# EAGLE design HBridge (EAGLE 6.5.0)
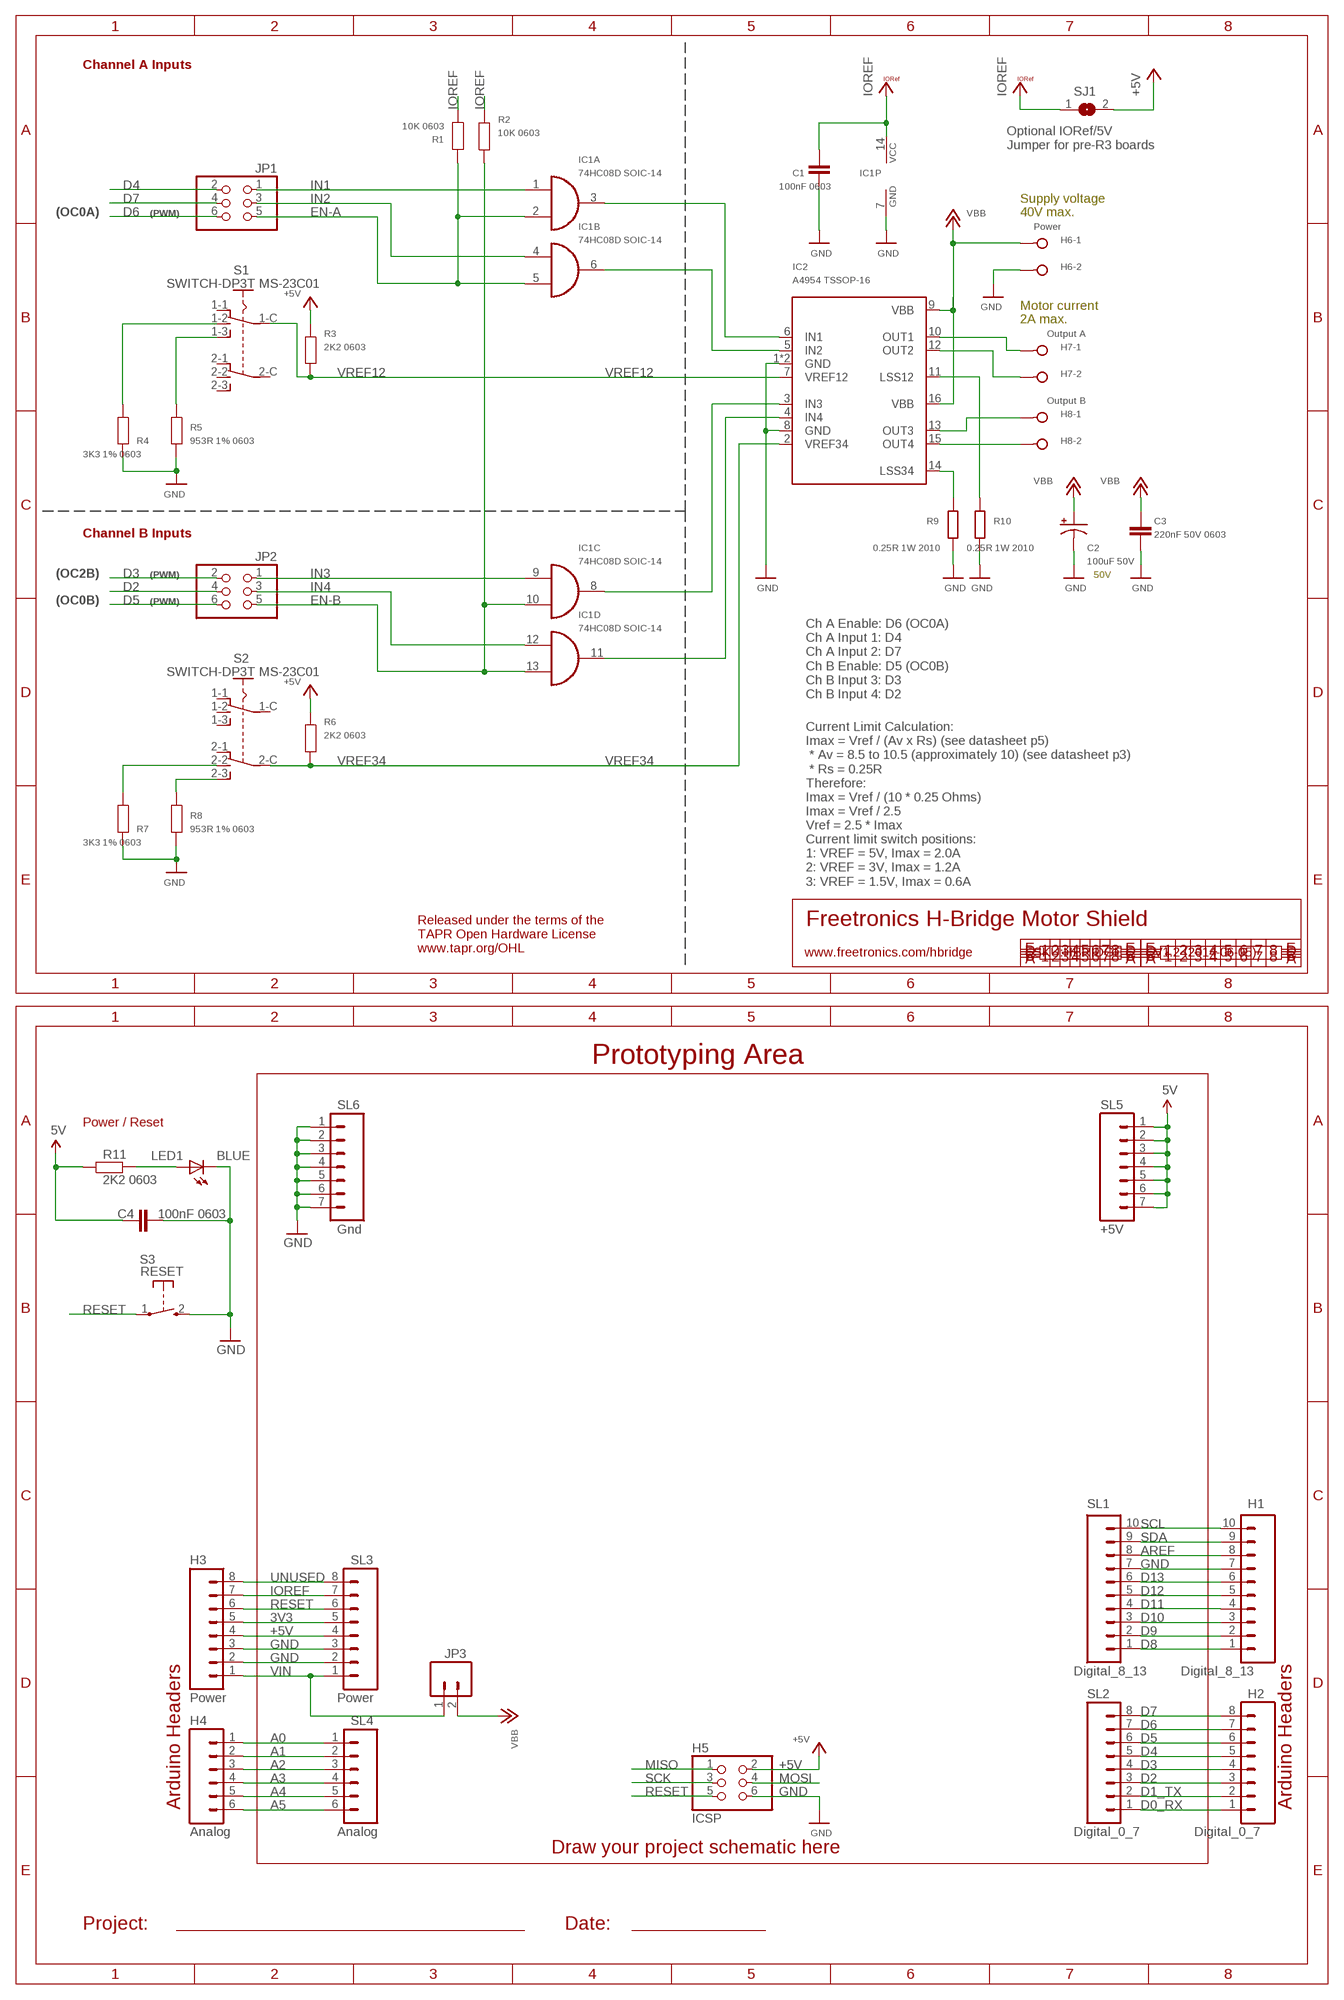
[diagram p0: schematic, sheet 1]

## Parts
C1  100nF 0603  CAP0603  [0603]
C2  100uF 50V  CAP_POLE  [PANASONIC_E]
C3  220nF 50V 0603  CAP0603  [0603]
C4  100nF 0603  CAP0603  [0603]
H1  Digital_8_13  M100.1  [1X10]
H2  Digital_0_7  M08  [1X08]
H3  Power  M08  [1X08]
H4  Analog  M06SIP  [1X06]
H5  ICSP  PINHD-2X3  [2X03]
H6  Power  W237-02P  [W237-132]
H7  Output A  W237-02P  [W237-132]
H8  Output B  W237-02P  [W237-132]
IC1  74HC08D SOIC-14  74LS08D  [SO14]
IC2  A4954 TSSOP-16  A4954  [TSSOP16-LP]
JP1  PINHD-2X3  [2X03]
JP2  PINHD-2X3  [2X03]
JP3  M02PTH  [1X02]
LED1  BLUE  LED0603  [LED-0603]
R1  10K 0603  RESISTOR0603  [0603]
R2  10K 0603  RESISTOR0603  [0603]
R3  2K2 0603  RESISTOR0603  [0603]
R4  3K3 1% 0603  RESISTOR0603  [0603]
R5  953R 1% 0603  RESISTOR0603  [0603]
R6  2K2 0603  RESISTOR0603  [0603]
R7  3K3 1% 0603  RESISTOR0603  [0603]
R8  953R 1% 0603  RESISTOR0603  [0603]
R9  0.25R 1W 2010  R-EU_R2010  [R2010]
R10  0.25R 1W 2010  R-EU_R2010  [R2010]
R11  2K2 0603  RESISTOR0603  [0603]
S1  SWITCH-DP3T MS-23C01  SWITCH-DP3T  [MS-23C01]
S2  SWITCH-DP3T MS-23C01  SWITCH-DP3T  [MS-23C01]
S3  RESET  TAC_SWITCH_2PIN  [TACTILE_SWITCH_SMD_2PIN_TINY]
SJ1  SJ  [SJ]
SL1  Digital_8_13  M100.1  [1X10]
SL2  Digital_0_7  M08  [1X08]
SL3  Power  M08  [1X08]
SL4  Analog  M06SIP  [1X06]
SL5  +5V  M07  [1X07]
SL6  Gnd  M07  [1X07]

## Nets
3V3: H3.5 SL3.5
+5V: C4.1 H3.4 H5.2 R3.1 R6.1 R11.1 SJ1.2 SL3.4 SL5.1 SL5.2 SL5.3 SL5.4 SL5.5 SL5.6 SL5.7 ; supply symbol labelled 5V
A0: H4.1 SL4.1
A1: H4.2 SL4.2
A2: H4.3 SL4.3
A3: H4.4 SL4.4
A4: H4.5 SL4.5
A5: H4.6 SL4.6
AREF: H1.8 SL1.8
D0_RX: H2.1 SL2.1
D1_TX: H2.2 SL2.2
D2: H2.3 JP2.4 SL2.3
D3: H2.4 JP2.2 SL2.4
D4: H2.5 JP1.2 SL2.5
D5: H2.6 JP2.6 SL2.6
D6: H2.7 JP1.6 SL2.7
D7: H2.8 JP1.4 SL2.8
D8: H1.1 SL1.1
D9: H1.2 SL1.2
D10: H1.3 SL1.3
D11: H1.4 SL1.4
D12: H1.5 SL1.5
D13: H1.6 SL1.6
EN-A: IC1.2(A:I1) IC1.5(B:I1) JP1.5 R1.2
EN-B: IC1.10(C:I1) IC1.13(D:I1) JP2.5 R2.1
GND: C1.2 C2.- C3.2 C4.2 H1.7 H3.2 H3.3 H5.6 H6.2 IC1.7(P:GND) IC2.1(GND) IC2.8(GND) IC2.EXP(GND) LED1.C R4.2 R5.2 R7.2 R8.2 R9.1 R10.1 S3.2(S) SL1.7 SL3.2 SL3.3 SL6.1 SL6.2 SL6.3 SL6.4 SL6.5 SL6.6 SL6.7
IN1: IC1.1(A:I0) JP1.1
IN2: IC1.4(B:I0) JP1.3
IN3: IC1.9(C:I0) JP2.1
IN4: IC1.12(D:I0) JP2.3
IOREF: C1.1 H3.7 IC1.14(P:VCC) R1.1 R2.2 SJ1.1 SL3.7
MISO: H5.1
MOSI: H5.4
N$4: R8.1 S2.2-3
N$5: IC1.11(D:O) IC2.4(IN4)
N$6: IC1.8(C:O) IC2.3(IN3)
N$7: IC1.6(B:O) IC2.5(IN2)
N$8: IC1.3(A:O) IC2.6(IN1)
N$9: H7.1 IC2.10(OUT1)
N$10: H7.2 IC2.12(OUT2)
N$11: H8.1 IC2.13(OUT3)
N$12: H8.2 IC2.15(OUT4)
N$13: IC2.14(LSS34) R9.2
N$14: IC2.11(LSS12) R10.2
N$15: R4.1 S1.1-2
N$21: R5.1 S1.1-3
N$22: LED1.A R11.2
N$49: R7.1 S2.2-2
RESET: H3.6 H5.5 S3.1(P) SL3.6
SCK: H5.3
SCL: H1.10 SL1.10
SDA: H1.9 SL1.9
UNUSED: H3.8 SL3.8
VBB: C2.+ C3.1 H6.1 IC2.9(VBB) IC2.16(VBB) JP3.2
VIN: H3.1 JP3.1 SL3.1
VREF12: IC2.7(VREF12) R3.2 S1.1-C
VREF34: IC2.2(VREF34) R6.2 S2.2-C
Unconnected: S1.1-1 S1.2-1 S1.2-2 S1.2-3 S1.2-C S2.1-1 S2.1-2 S2.1-3 S2.1-C S2.2-1

## Notes on the sheet
- Channel A Inputs
- Optional IORef/5V
  Jumper for pre-R3 boards
- Supply voltage
- (OC0A) | (PWM) | 40V max.
- Motor current
- 2A max.
- Channel B Inputs
- (OC2B) | (PWM) | 50V
- (OC0B) | (PWM)
- Ch A Enable: D6 (OC0A)
  Ch A Input 1: D4
  Ch A Input 2: D7
  Ch B Enable: D5 (OC0B)
  Ch B Input 3: D3
  Ch B Input 4: D2
- Current Limit Calculation:
  Imax = Vref / (Av x Rs) (see datasheet p5)
   * Av = 8.5 to 10.5 (approximately 10) (see datasheet p3)
   * Rs = 0.25R
  Therefore:
  Imax = Vref / (10 * 0.25 Ohms)
  Imax = Vref / 2.5
  Vref = 2.5 * Imax
  Current limit switch positions:
  1: VREF = 5V, Imax = 2.0A
  2: VREF = 3V, Imax = 1.2A
  3: VREF = 1.5V, Imax = 0.6A
- Freetronics H-Bridge Motor Shield
- Released under the terms of the 
  TAPR Open Hardware License
  www.tapr.org/OHL
- www.freetronics.com/hbridge | SKU:HBRIDGE | V1.2 (2014-06-05)
- Prototyping Area
- Power / Reset
- Arduino Headers | Arduino Headers
- Draw your project schematic here
- Project: | Date:

## Library data of the parts
C1 C3 = freetronics-master-v1:CAP: Capacitor Standard 0603 ceramic capacitor, and 0.1" leaded capacitor.
C2 = freetronics-master-v1:CAP_POL: Capacitor Polarized These are standard SMD and PTH capacitors. Normally 10uF, 47uF, and 100uF in electrolytic and tantalum varieties. Always verify the external diameter of the through hole cap, it varies with capacity, voltage, and manufacturer. The EIA devices should be standard.
C4 = freetronics:CAP: Capacitor Standard 0603 ceramic capacitor, and 0.1" leaded capacitor.
H1 SL1 = freetronics-original:M10: Header 10 Standard 10-pin 0.1" header. Use with straight break away headers (SKU : PRT-00116), right angle break away headers (PRT-00553), swiss pins (PRT-00743), machine pins (PRT-00117), and female headers (PRT-00115).
H2 H3 SL2 SL3 = freetronics:M08: Header 8 Standard 8-pin 0.1" header. Use with straight break away headers (SKU : PRT-00116), right angle break away headers (PRT-00553), swiss pins (PRT-00743), machine pins (PRT-00117), and female headers (PRT-00115).
H4 SL4 = freetronics:M06: Header 6 Standard 6-pin 0.1" header. Use with straight break away headers (SKU : PRT-00116), right angle break away headers (PRT-00553), swiss pins (PRT-00743), machine pins (PRT-00117), and female headers (PRT-00115). Molex polarized connector foot print use with SKU : PRT-08094 with associated crimp pins and housings. NOTES ON THE VARIANTS LOCK and LOCK_LONGPADS... This footprint was designed to help hold the alignment of a through-hole component (i.e. 6-pin header) while soldering it into place. You may notice that each hole has been shifted either up or down by 0.005 of an inch from it's more standard position (which is a perfectly straight line). This slight alteration caused the pins (the squares in the middle) to touch the edges of the holes. Because they are alternating, it causes a "brace" to hold the component in place. 0.005 has proven to be the perfect amount of "off-center" position when using our standard breakaway headers. Although looks a little odd when you look at the bare footprint, once you have a header in there, the alteration is very hard to notice. Also, if you push a header all the way into place, it is covered up entirely on the bottom side. This idea of altering the position of holes to aid alignment will be further integrated into the Sparkfun Library for other footprints. It can help hold any component with 3 or more connection pins.
H5 JP1 JP2 = freetronics-master-v1:PINHD-2X3: PIN HEADER
H6-H8 = con-wago-508:W237-02P: WAGO SREW CLAMP; OC_FARNELL: unknown; OC_NEWARK: unknown
IC1 = 74xx-eu:74*08: Quad 2-input AND gate
IC2 = freetronics-luke:A4954: Allegro A4954 Dual Full-Bridge PWM Motor Driver http://www.allegromicro.com/~/Media/Files/Datasheets/A4954-Datasheet.ashx
JP3 = freetronics-master-v1:M02: Header 2 Standard 2-pin 0.1" header. Use with straight break away headers (SKU : PRT-00116), right angle break away headers (PRT-00553), swiss pins (PRT-00743), machine pins (PRT-00117), and female headers (PRT-00115). Molex polarized connector foot print use with SKU : PRT-08233 with associated crimp pins and housings.
LED1 = freetronics:LED: LEDs Standard schematic elements and footprints for 5mm, 3mm, 1206, and 0603 sized LEDs. 5mm - Spark Fun Electronics SKU : COM-00529 (and others)
R1-R8 = freetronics-master-v1:RESISTOR: Resistor Basic schematic elements and footprints for 0603, 1206, and PTH 1/10th watt (small) resistors.
R9 R10 = rcl:R-EU_: RESISTOR, European symbol
R11 = freetronics:RESISTOR: Resistor Basic schematic elements and footprints for 0603, 1206, and PTH 1/10th watt (small) resistors.
S1 S2 = freetronics-jon:SWITCH-DP3T
S3 = freetronics-master-v1:TAC_SWITCH_2PIN: Momentary Tactile Switch - 2 pin
SJ1 = freetronics-master-v1.1:SJ: SMD solder JUMPER
SL5 SL6 = SparkFun:M07: Header 7 Standard 7-pin 0.1" header. Use with straight break away headers (SKU : PRT-00116), right angle break away headers (PRT-00553), swiss pins (PRT-00743), machine pins (PRT-00117), and female headers (PRT-00115). NOTES ON THE VARIANTS LOCK and LOCK_LONGPADS... This footprint was designed to help hold the alignment of a through-hole component (i.e. 7-pin header) while soldering it into place. You may notice that each hole has been shifted either up or down by 0.005 of an inch from it's more standard position (which is usually a perfectly straight line). This slight alteration caused the pins (the squares in the middle) to touch the edges of the holes. Because they are alternating, it causes a "brace" to hold the header in place. 0.005 has proven to be the perfect amount of "off-center" position when using our standard breakaway headers. Although looks a little odd when you look at the bare footprint, once you have a header in there, the alteration is very hard to notice. Also, if you push a header all the way into place, it is covered up entirely on the bottom side. This idea of altering the position of holes to aid alignment will be further integrated into the Sparkfun Library for other footprints. It can help hold any component with 3 or more connection pins.

## Board
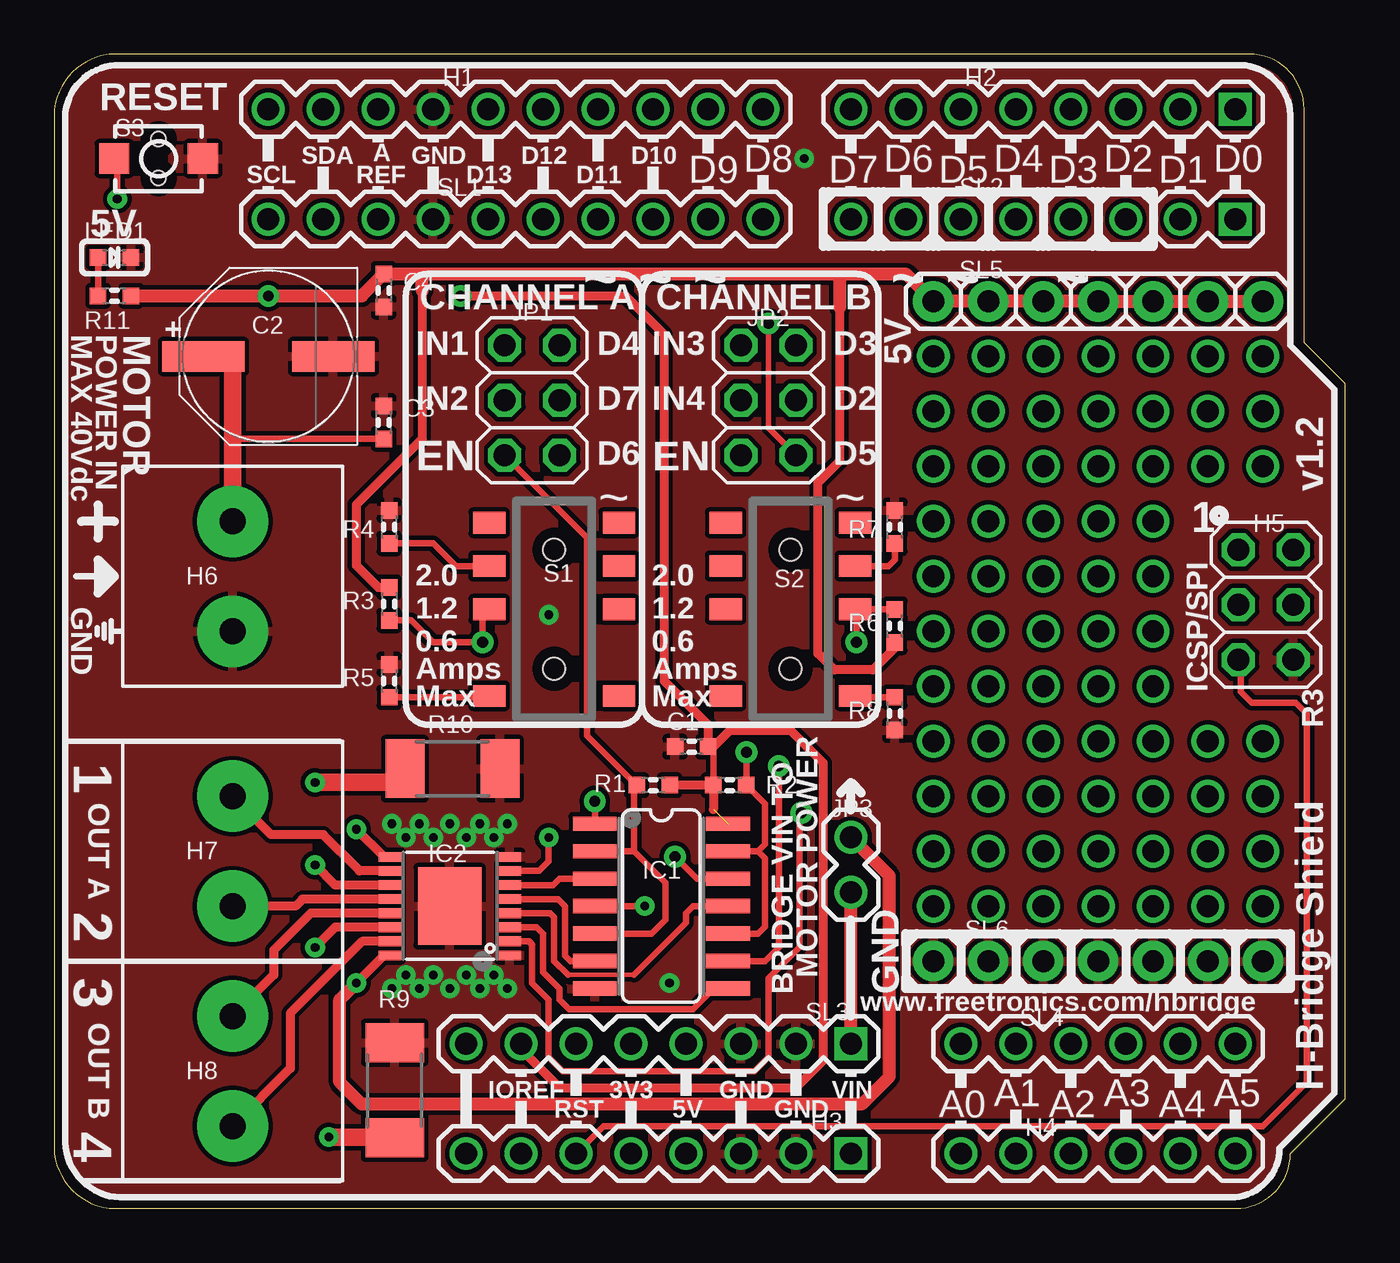
[diagram p1: board, top side]
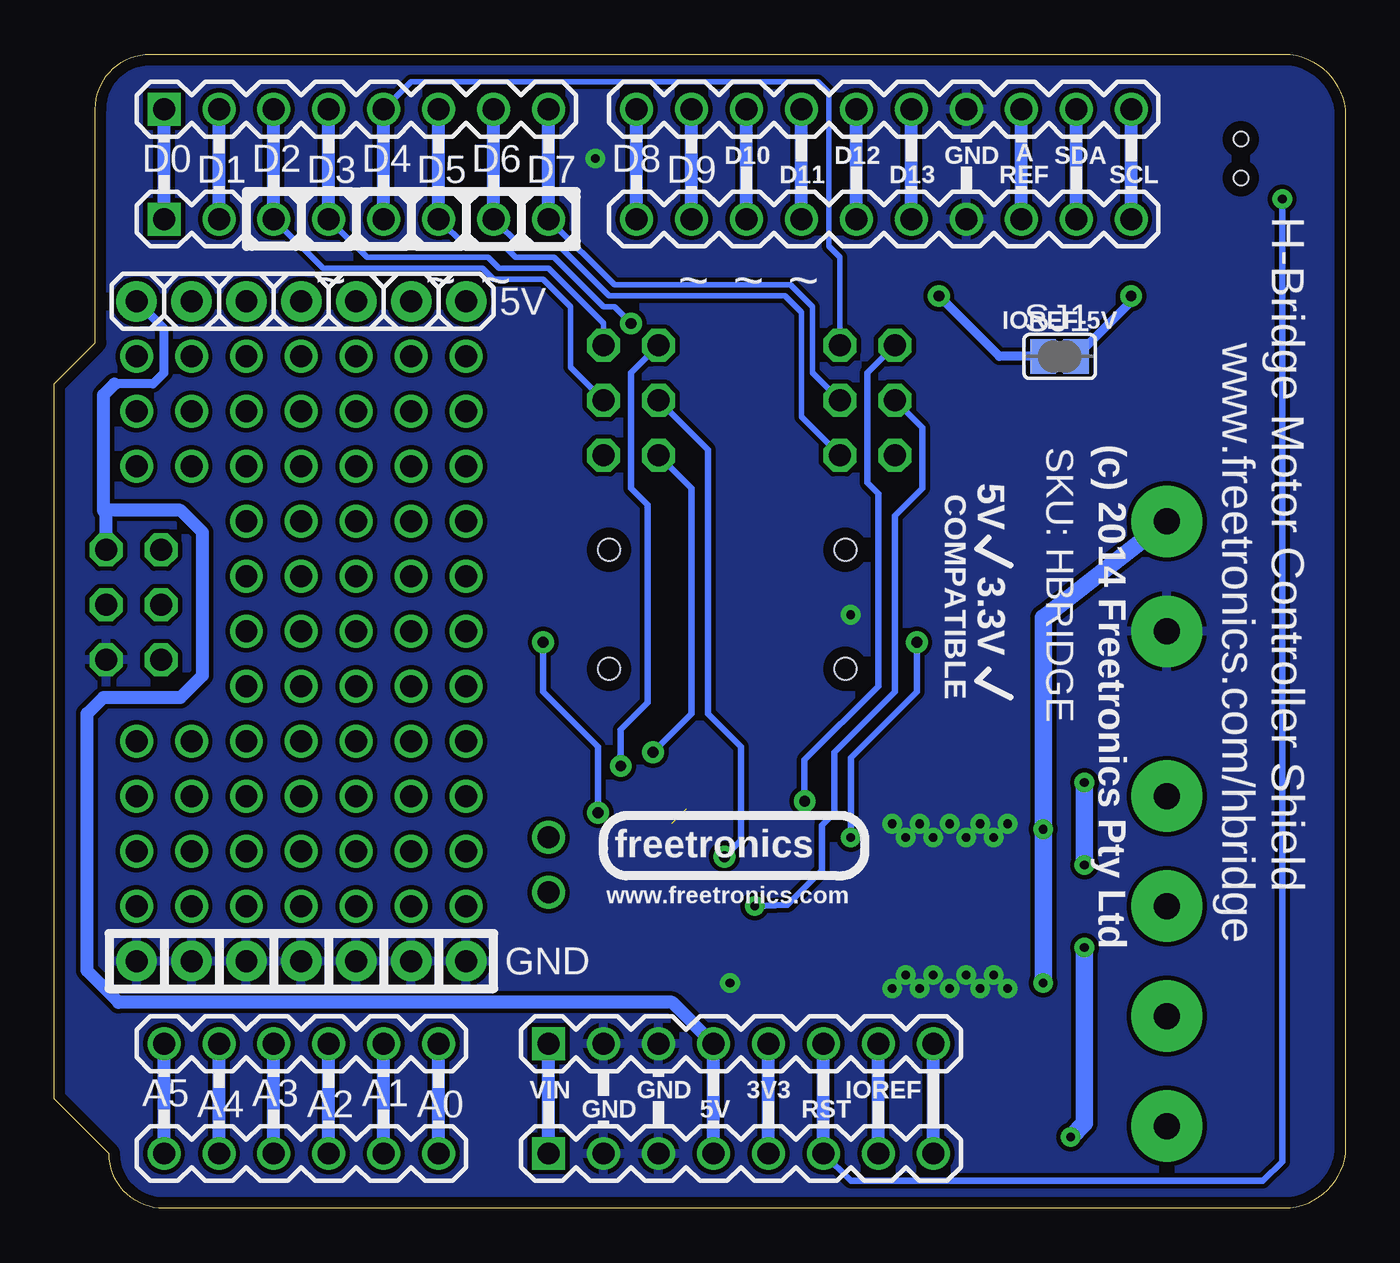
[diagram p2: board, bottom side, seen from below]

Size 59.69 x 53.34 mm. Coordinates in mm from the lower left corner, seen from the top.
Outline: 0,2.54 arc74 2.54,0 54.61,0 arc90 57.15,2.54 59.69,5.08 59.69,38.1 57.78,40.01 57.78,50.8 arc90 55.24,53.34 2.54,53.34 arc74 0,50.8 0,2.54
Copper layers (1*16): Top 0.035mm / dielectric 1.5mm / Bottom 0.035mm
Design rules "default": minimum track width 8mil, minimum drill 0.4mm, track to track 8mil, track to pad 8mil, pad to pad 8mil, via to via 8mil, smd to smd 8mil, copper to edge 20mil, drill to drill 8mil, minimum pad ring 8mil, minimum via ring 10mil, stop-mask expansion 3mil, vias tented up to drill 25mil, thermal gap 8mil

### Footprints (pad centres in the part's own frame; a part is rotated, then mirrored left to right if it is on the bottom)
0603 = smd 0.762 x 0.762: 1 -0.762,0; 2 0.762,0
PANASONIC_E = smd 3.8 x 1.4: + 3,0; - -3,0
1X10 = drill 1.016: 1 0,0; 2 2.54,0; 3 5.08,0; 4 7.62,0; 5 10.16,0; 6 12.7,0; 7 15.24,0; 8 17.78,0; 9 20.32,0; 10 22.86,0
1X08 = drill 1.016 square: 1 0,0 | drill 1.016: 2 2.54,0; 3 5.08,0; 4 7.62,0; 5 10.16,0; 6 12.7,0; 7 15.24,0; 8 17.78,0
1X06 = drill 1.016: 1 0,0; 2 2.54,0; 3 5.08,0; 4 7.62,0; 5 10.16,0; 6 12.7,0
2X03 = drill 1.016 octagon: 1 -2.54,-1.27; 2 -2.54,1.27; 3 0,-1.27; 4 0,1.27; 5 2.54,-1.27; 6 2.54,1.27
W237-132 = drill 1.2 pad 3.302: 1 -2.54,-0.635; 2 2.54,-0.635
SO14 = smd 0.66 x 2.032: 1 -3.81,-3.073; 2 -2.54,-3.073; 3 -1.27,-3.073; 4 0,-3.073; 5 1.27,-3.073; 6 2.54,-3.073; 7 3.81,-3.073; 8 3.81,3.073; 9 2.54,3.073; 10 1.27,3.073; 11 0,3.073; 12 -1.27,3.073; 13 -2.54,3.073; 14 -3.81,3.073
TSSOP16-LP = smd 0.45 x 1.05: 1 -2.275,-2.768; 2 -1.625,-2.768; 3 -0.975,-2.768; 4 -0.325,-2.768; 5 0.325,-2.768; 6 0.975,-2.768; 7 1.625,-2.768; 8 2.275,-2.768; 9 2.275,2.768; 10 1.625,2.768; 11 0.975,2.768; 12 0.325,2.768; 13 -0.325,2.768; 14 -0.975,2.768; 15 -1.625,2.768; 16 -2.275,2.768 | smd 3.58 x 2.94: EXP 0,0
1X02 = drill 1.016: 1 0,0; 2 2.54,0
LED-0603 = smd 0.762 x 0.762: A -0.762,0; C 0.762,0
R2010 = smd 1.8 x 2.7: 1 -2.2,0; 2 2.2,0
MS-23C01 = smd 1.5 x 1: 1-1 -3,4; 1-2 -3,2; 1-3 -3,-4; 1-C -3,0; 2-1 3,4; 2-2 3,2; 2-3 3,-4; 2-C 3,0 | hole 1: 0,2.75; 0,-2.75
TACTILE_SWITCH_SMD_2PIN_TINY = smd 1.4 x 1.4: 1 -2.05,0; 2 2.05,0 | hole 0.65: 0,0.9; 0,-0.9
SJ = smd 1.168 x 1.6: 1 -0.762,0; 2 0.762,0
1X07 = drill 1.016 pad 1.88: 1 0,0; 2 2.54,0; 3 5.08,0; 4 7.62,0; 5 10.16,0; 6 12.7,0; 7 15.24,0

### Placement (x,y rotation side)
C1  29.46,21.34 180 top
C2  9.91,39.37 180 top
C3  15.24,36.32 90 top
C4  15.24,42.42 270 top
H1  32.77,50.8 180 top
H2  54.61,50.8 180 top
H3  36.83,2.54 180 top
H4  41.91,2.54 0 top
H5  56.02,27.89 270 top
H6  8.89,29.21 270 top
H7  8.89,16.51 270 top
H8  8.89,6.35 270 top
IC1  28.07,13.97 270 top
IC2  18.29,13.97 90 top
JP1  22.1,37.34 270 top
JP2  33.02,37.34 270 top
JP3  36.83,14.61 90 top
LED1  2.79,43.94 0 top
R1  27.69,19.56 180 top
R2  31.24,19.56 180 top
R3  15.49,27.94 270 top
R4  15.49,31.5 90 top
R5  15.49,24.38 90 top
R6  38.86,26.92 90 top
R7  38.86,31.5 90 top
R8  38.86,22.86 270 top
R9  15.75,5.46 270 top
R10  18.41,20.32 180 top
R11  2.79,42.16 180 top
S1  23.11,27.69 0 top
S2  34.04,27.69 0 top
S3  4.83,48.51 0 top
SJ1  13.21,39.37 0 bottom
SL1  32.77,45.72 180 top
SL2  54.61,45.72 180 top
SL3  36.83,7.62 180 top
SL4  41.91,7.62 0 top
SL5  55.88,41.91 180 top
SL6  55.88,11.43 180 top

### Tracks (layer width: path | path; a pad name or v marks a point on that pad's centre or on a via)
3V3
  Bottom 0.61: H3.5 SL3.5
+5V  (via drill 0.5)
  Top 0.406: 17.02,42.42 17.02,35.56 13.97,32.51 13.97,29.72 14.99,28.7 R3.1 | R6.1 38.86,25.91 37.85,24.89 36.07,24.89 35.31,25.65 35.31,33.53 36.32,34.54 36.32,41.66
  Top 0.61: SL5.1 SL5.2 SL5.3 SL5.4 SL5.5 SL5.6 SL5.7 39.37,43.18 36.32,43.18 | R11.1 v9.91,42.16 14.22,42.16 C4.1 17.02,43.18 | 17.02,43.18 36.32,43.18 | 36.32,41.66 36.32,43.18 | 17.02,42.42 17.02,43.18
  Bottom 0.406: 56.9,38.1 55.12,38.1 54.61,38.61 54.61,40.64 SL5.1 | SJ1.2 9.91,41.91 v9.91,42.16
  Bottom 0.61: H3.4 SL3.4 31.11,9.53 56.71,9.53 58.17,10.99 58.17,22.86 57.4,23.62 53.85,23.62 52.83,24.64 52.83,31.24 53.85,32.26 57.4,32.26 | 57.4,32.26 57.4,37.59 56.9,38.1 | H5.2 57.29,32.14 57.4,32.26
A0
  Bottom 0.61: H4.1 SL4.1
A1
  Bottom 0.61: H4.2 SL4.2
A2
  Bottom 0.61: H4.3 SL4.3
A3
  Bottom 0.61: H4.4 SL4.4
A4
  Bottom 0.61: H4.5 SL4.5
A5
  Bottom 0.61: H4.6 SL4.6
AREF
  Bottom 0.61: SL1.8 H1.8
D0_RX
  Bottom 0.61: SL2.1 H2.1
D1_TX
  Bottom 0.61: SL2.2 H2.2
D2
  Bottom 0.254: SL2.3 47.24,43.43 39.88,43.43 39.37,42.93 37.08,42.93 35.81,41.66 35.81,38.86 JP2.4
  Bottom 0.61: SL2.3 H2.3
D3
  Bottom 0.254: SL2.4 45.21,43.94 39.62,43.94 39.12,43.43 36.83,43.43 34.29,40.89 JP2.2
  Bottom 0.61: SL2.4 H2.4
D4
  Bottom 0.254: JP1.2 23.37,43.94 23.88,44.45 23.88,51.56 24.38,52.07 43.18,52.07 H2.5
  Bottom 0.61: SL2.5 H2.5
D5  (via drill 0.5)
  Top 0.254: v33.02,40.89 33.02,36.07 JP2.6
  Bottom 0.254: SL2.6 40.64,44.45 38.86,44.45 38.35,43.94 36.58,43.94 34.29,41.66 33.78,41.66 v33.02,40.89
  Bottom 0.61: SL2.6 H2.6
D6
  Bottom 0.254: SL2.7 38.1,44.45 36.32,44.45 34.04,42.16 25.91,42.16 25.15,41.4 25.15,36.58 JP1.6
  Bottom 0.61: SL2.7 H2.7
D7
  Bottom 0.254: SL2.8 33.78,42.67 25.65,42.67 24.64,41.66 24.64,38.61 JP1.4
  Bottom 0.61: SL2.8 H2.8
D8
  Bottom 0.61: SL1.1 H1.1
D9
  Bottom 0.61: SL1.2 H1.2
D10
  Bottom 0.61: SL1.3 H1.3
D11
  Bottom 0.61: SL1.4 H1.4
D12
  Bottom 0.61: SL1.5 H1.5
D13
  Bottom 0.61: SL1.6 H1.6
EN-A
  Top 0.203: 26.35,16.51 IC1.2
  Top 0.305: 26.8,16.51 IC1.2 | IC1.5 27.62,12.7 28.26,13.34 28.26,15.05 26.8,16.51 | 26.8,16.51 26.8,19.43 R1.2 24.64,21.84 24.64,30.99 JP1.5
EN-B  (via drill 0.5)
  Top 0.305: IC1.10 32.54,12.7 32.86,13.02 32.86,16.19 32.54,16.51 | 32.54,16.51 IC1.13 | 32.54,16.51 32.86,16.83 32.86,18.7 R2.1 v32,21.08
  Bottom 0.305: v32,21.08 30.23,22.86 30.23,33.27 JP2.5
GND  (via drill 0.4)
  other vias: 17.53,17.14 18.29,17.78 17.53,10.79 18.29,10.16 19.05,10.79 19.68,10.16 20.32,10.79 19.05,17.14 16.89,17.78 20.32,17.14 20.95,10.16 16.89,10.16 16.26,10.79 15.62,10.16 19.68,17.78 16.26,17.14 28.45,10.41 22.86,27.43 15.62,17.78 20.95,17.78 34.67,48.51
  pour Bottom: 0,50.8 arc-74 2.54,53.34 55.24,53.34 arc-74 57.78,50.96 57.78,40.01 59.69,38.1 59.69,5.08 57.15,2.54 arc-74 54.61,0 2.54,0 arc-74 0,2.54
  pour Top: 0,50.8 arc-74 2.54,53.34 55.24,53.34 arc-74 57.78,50.96 57.78,40.01 59.69,38.1 59.69,5.08 57.15,2.54 arc-74 54.61,0 2.54,0 arc-74 0,2.54
IN1  (via drill 0.5)
  Top 0.305: IC1.1 v24.99,18.82
  Bottom 0.305: v24.99,18.82 24.99,20.73 21.59,24.13 21.59,33.02 22.1,33.53 22.1,38.61 JP1.1
IN2  (via drill 0.4)
  Top 0.305: v27.3,13.97 IC1.4
  Bottom 0.305: v27.3,13.97 25.78,14.03 24.19,15.62 24.19,17.72 23.62,18.29 23.62,21.08 20.83,23.88 20.83,32 19.56,33.27 19.56,36.07 JP1.3
IN3  (via drill 0.5)
  Top 0.305: IC1.9 32.86,11.43 33.5,12.06 v33.5,20.45
  Bottom 0.305: v33.5,20.45 33.5,22.13 32.26,23.37 32.26,32.51 33.02,33.27 33.02,38.61 JP2.1
IN4  (via drill 0.5)
  Top 0.305: IC1.12 29.72,15.24 v28.7,16.26
  Bottom 0.305: v28.7,16.26 27.94,17.02 27.94,21.34 29.46,22.86 29.46,35.05 JP2.3
IOREF  (via drill 0.5)  (1 unrouted)
  Top 0.305: 30.48,21.34 R2.2
  Top 0.406: SL3.7 21.59,7.37 23.37,5.59 34.29,5.59 35.56,6.86 35.56,20.57 34.04,22.1 31.24,22.1 30.48,21.34 C1.1 30.23,22.35 28.19,24.38 28.19,40.39 26.42,42.16 v18.8,42.16 | R1.1 R2.2 30.48,18.44
  Bottom 0.406: SJ1.1 16,39.37 v18.8,42.16
  Bottom 0.61: H3.7 SL3.7
N$4
  Top 0.305: R8.1 37.1,23.62 S2.2-3
N$5
  Top 0.203: 23.75,10.79 26.8,10.79
  Top 0.305: IC1.11 29.53,13.97 29.21,13.65 29.21,13.21 26.8,10.79 | IC2.4 22.93,13.64 23.11,13.46 23.11,11.43 23.75,10.79
N$6
  Top 0.305: 30.48,10.16 29.53,9.21 23.81,9.21 23.37,9.65 23.37,10.16 22.61,10.92 22.61,12.7 22.31,12.99 IC2.3
  Top 0.406: 30.48,10.16 IC1.8
N$7
  Top 0.305: IC2.5 23.3,14.29 23.62,13.97 23.62,11.68 23.88,11.43 IC1.6
N$8
  Top 0.305: IC2.6 23.07,14.95 23.37,15.24 IC1.3
N$9
  Top 0.406: IC2.10 14.12,15.6 12.45,17.27 10.03,17.27 H7.1
N$10
  Top 0.406: IC2.12 11.49,14.29 11.16,13.97 H7.2
N$11
  Top 0.406: IC2.13 11.87,13.64 10.16,11.94 10.16,10.79 H8.1
N$12
  Top 0.406: IC2.15 14.25,12.35 10.92,9.02 10.92,6.48 H8.2
N$13  (via drill 0.4)
  Top 0.203: 15.62,3.3 R9.2
  Top 0.406: IC2.14 12.99,12.99 v12.06,12.06
  Top 0.813: 15.62,3.3 v12.7,3.3
  Bottom 0.813: v12.06,12.06 12.06,3.94 v12.7,3.3
N$14  (via drill 0.4)
  Top 0.305: 15.24,19.68 15.88,20.32 R10.2
  Top 0.406: IC2.11 12.99,14.95 v12.06,15.88
  Top 0.813: v12.06,19.68 15.24,19.68
  Bottom 0.813: v12.06,15.88 v12.06,19.68
N$15
  Top 0.305: S1.1-2 18.57,29.69 17.53,30.73 R4.1
N$21
  Top 0.305: R5.1 20.05,23.62 S1.1-3
N$22
  Top 0.305: LED1.A R11.2
N$23  (via drill 1.02)
  other vias: 48.26,16.51
N$24  (via drill 1.02)
  other vias: 43.18,34.29
N$25  (via drill 1.02)
  other vias: 43.18,29.21
N$26  (via drill 1.02)
  other vias: 40.64,26.67
N$27  (via drill 1.02)
  other vias: 40.64,31.75
N$28  (via drill 1.02)
  other vias: 43.18,24.13
N$29  (via drill 1.02)
  other vias: 43.18,26.67
N$30  (via drill 1.02)
  other vias: 40.64,24.13
N$31  (via drill 1.02)
  other vias: 45.72,21.59
N$32  (via drill 1.02)
  other vias: 43.18,21.59
N$33  (via drill 1.02)
  other vias: 40.64,21.59
N$34  (via drill 1.02)
  other vias: 45.72,19.05
N$35  (via drill 1.02)
  other vias: 45.72,16.51
N$36  (via drill 1.02)
  other vias: 45.72,13.97
N$37  (via drill 1.02)
  other vias: 43.18,19.05
N$38  (via drill 1.02)
  other vias: 50.8,19.05
N$39  (via drill 1.02)
  other vias: 48.26,19.05
N$40  (via drill 1.02)
  other vias: 40.64,19.05
N$41  (via drill 1.02)
  other vias: 43.18,16.51
N$42  (via drill 1.02)
  other vias: 40.64,39.37
N$43  (via drill 1.02)
  other vias: 40.64,34.29
N$44  (via drill 1.02)
  other vias: 43.18,13.97
N$45  (via drill 1.02)
  other vias: 40.64,29.21
N$46  (via drill 1.02)
  other vias: 40.64,16.51
N$47  (via drill 1.02)
  other vias: 40.64,13.97
N$48  (via drill 1.02)
  other vias: 50.8,16.51
N$49
  Top 0.305: S2.2-2 38.58,29.69 38.86,29.97 R7.1
N$54  (via drill 1.02)
  other vias: 50.8,21.59
N$55  (via drill 1.02)
  other vias: 48.26,21.59
N$61  (via drill 1.02)
  other vias: 50.8,13.97
N$70  (via drill 1.02)
  other vias: 50.8,24.13
N$71  (via drill 1.02)
  other vias: 48.26,24.13
N$77  (via drill 1.02)
  other vias: 43.18,31.75
N$86  (via drill 1.02)
  other vias: 50.8,26.67
N$87  (via drill 1.02)
  other vias: 48.26,26.67
N$88  (via drill 1.02)
  other vias: 45.72,26.67
N$93  (via drill 1.02)
  other vias: 45.72,24.13
N$102  (via drill 1.02)
  other vias: 50.8,29.21
N$103  (via drill 1.02)
  other vias: 48.26,29.21
N$104  (via drill 1.02)
  other vias: 45.72,29.21
N$109  (via drill 1.02)
  other vias: 48.26,13.97
N$118  (via drill 1.02)
  other vias: 50.8,31.75
N$119  (via drill 1.02)
  other vias: 48.26,31.75
N$120  (via drill 1.02)
  other vias: 45.72,31.75
N$121  (via drill 1.02)
  other vias: 40.64,36.83
N$134  (via drill 1.02)
  other vias: 50.8,34.29
N$135  (via drill 1.02)
  other vias: 48.26,34.29
N$136  (via drill 1.02)
  other vias: 45.72,34.29
N$150  (via drill 1.02)
  other vias: 50.8,36.83
N$151  (via drill 1.02)
  other vias: 48.26,36.83
N$152  (via drill 1.02)
  other vias: 45.72,36.83
N$153  (via drill 1.02)
  other vias: 43.18,36.83
N$166  (via drill 1.02)
  other vias: 50.8,39.37
N$167  (via drill 1.02)
  other vias: 48.26,39.37
N$168  (via drill 1.02)
  other vias: 45.72,39.37
N$169  (via drill 1.02)
  other vias: 43.18,39.37
N$182  (via drill 1.02)
  other vias: 53.34,13.97
N$183  (via drill 1.02)
  other vias: 53.34,16.51
N$184  (via drill 1.02)
  other vias: 53.34,19.05
N$185  (via drill 1.02)
  other vias: 53.34,21.59
N$190  (via drill 1.02)
  other vias: 53.34,34.29
N$191  (via drill 1.02)
  other vias: 53.34,36.83
N$192  (via drill 1.02)
  other vias: 55.88,39.37
N$193  (via drill 1.02)
  other vias: 55.88,13.97
N$194  (via drill 1.02)
  other vias: 55.88,16.51
N$195  (via drill 1.02)
  other vias: 55.88,19.05
N$196  (via drill 1.02)
  other vias: 55.88,21.59
N$201  (via drill 1.02)
  other vias: 55.88,34.29
N$202  (via drill 1.02)
  other vias: 55.88,36.83
N$203  (via drill 1.02)
  other vias: 53.34,39.37
RESET  (via drill 0.4)
  Top 0.254: 54.86,25.24 H5.5
  Top 0.305: H3.6 25.4,3.81 55.88,3.81 57.91,5.84 57.91,22.86 57.4,23.37 55.37,23.37 54.86,23.88 54.86,25.24 | v2.92,46.64 2.92,48.51
  Top 0.406: 2.92,48.51 S3.1
  Bottom 0.305: H3.6 22.86,1.27 3.81,1.27 2.92,2.16 v2.92,46.64
  Bottom 0.61: H3.6 SL3.6
SCL
  Bottom 0.61: SL1.10 H1.10
SDA
  Bottom 0.61: SL1.9 H1.9
UNUSED
  Bottom 0.61: H3.8 SL3.8
VBB  (via drill 0.4)
  Top 0.305: C3.1 8.51,35.56 8.26,35.81
  Top 0.406: IC2.9 15.25,16.25 v13.97,17.53 | IC2.16 15.25,11.7 v13.97,10.41
  Top 0.61: v13.97,10.41 13.21,9.65 13.21,5.84 14.22,4.83 37.34,4.83 38.61,6.1 38.61,15.37 JP3.2
  Top 0.813: H6.1 8.26,35.81 8.26,39.24 8.38,39.37 C2.+
  Bottom 0.813: v13.97,10.41 v13.97,17.53 13.97,27.3 H6.1
VIN
  Top 0.61: SL3.1 JP3.1
  Bottom 0.61: H3.1 SL3.1
VREF12  (via drill 0.4, 0.5)
  Top 0.305: v22.86,17.14 22.86,16.03 22.42,15.6 IC2.7 | R3.2 16.51,27.18 17.53,26.16 v19.81,26.16 19.81,27.38 S1.1-C
  Bottom 0.305: v22.86,17.14 22.86,20.83 19.81,23.88 v19.81,26.16
VREF34  (via drill 0.5)
  Top 0.305: IC2.2 21.95,12.35 22.1,12.19 22.1,10.41 22.86,9.65 22.86,6.99 23.5,6.35 32.38,6.35 33.02,6.99 33.02,10.64 34.45,12.06 34.45,18.19 v34.54,18.29 | R6.2 S2.2-C 37.08,27.64 v37.08,26.16
  Bottom 0.305: v37.08,26.16 37.08,23.88 34.54,21.34 v34.54,18.29

### Text on the board
tPlace: RESET | SDA | A | GND | D12 | D10 | D8 | D6 | D4 | D2 | D0 | SCL | REF | D13 | D11 | D9 | D7 | D5 | D3 | D1 | 5V | CHANNEL A | ~ | ~ | CHANNEL B | ~ | ~ | ~ | ~ | MAX 40Vdc | POWER IN | MOTOR | + | IN1 | D4 | IN3 | D3 | 5V | IN2 | D7 | IN4 | D2 | EN | D6 | EN | D5 | v1.2 | ~ | ~ | 1 | 2.0 | 2.0 | GND | 1.2 | 1.2 | 0.6 | 0.6 | Amps | Amps | ICSP/SPI | Max | Max | R3 | 1 | OUT A | 2 | 3 | MOTOR POWER | BRIDGE VIN TO | GND | OUT B | www.freetronics.com/hbridge | IOREF | 3V3 | GND | VIN | A1 | A3 | A5 | H-Bridge Shield | 4 | RST | 5V | GND | A0 | A2 | A4
bPlace: SDA | A | GND | D12 | D10 | D8 | D6 | D4 | D2 | D0 | SCL | REF | D13 | D11 | D9 | D7 | D5 | D3 | D1 | H-Bridge Motor Controller Shield | ~ | ~ | ~ | ~ | ~ | ~ | IOREF-5V | 5V | www.freetronics.com/hbridge | (c) 2014 Freetronics Pty Ltd | SKU: HBRIDGE | 5V | COMPATIBLE | 3.3V | freetronics | www.freetronics.com | GND | IOREF | 3V3 | GND | VIN | A1 | A3 | A5 | RST | 5V | GND | A0 | A2 | A4
tNames: S3 | S1 | S2
tValues: RESET
tDocu: A | K | +